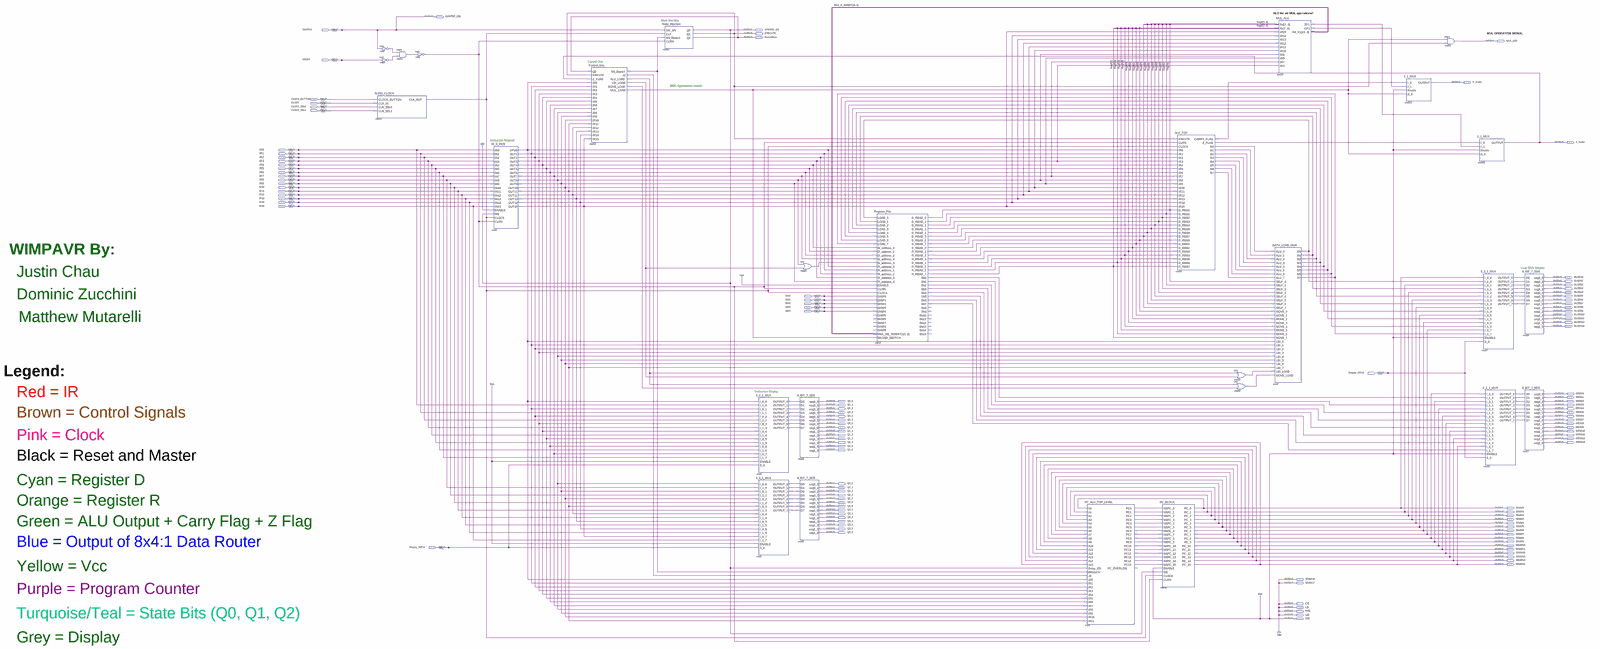
[diagram p0: schematic sheet, whole]
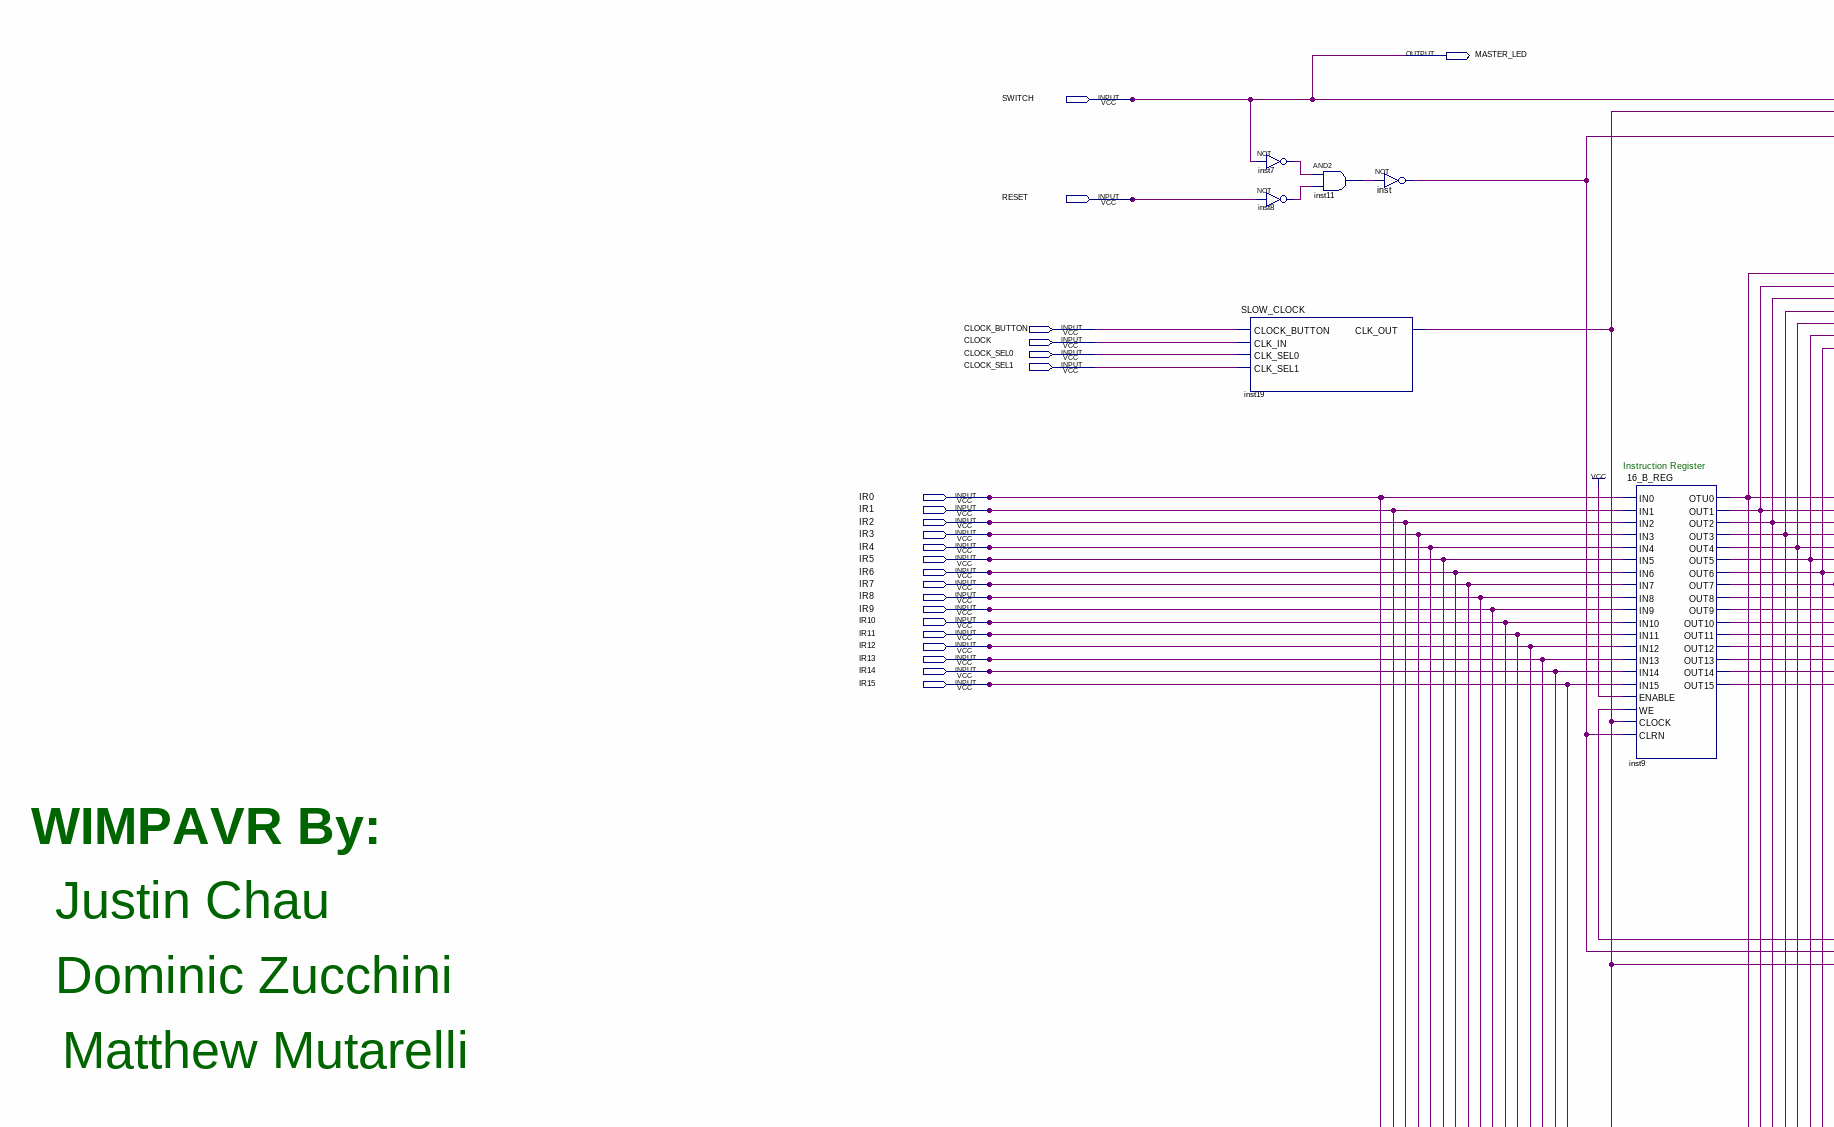
[diagram p1: schematic sheet, upper left part]
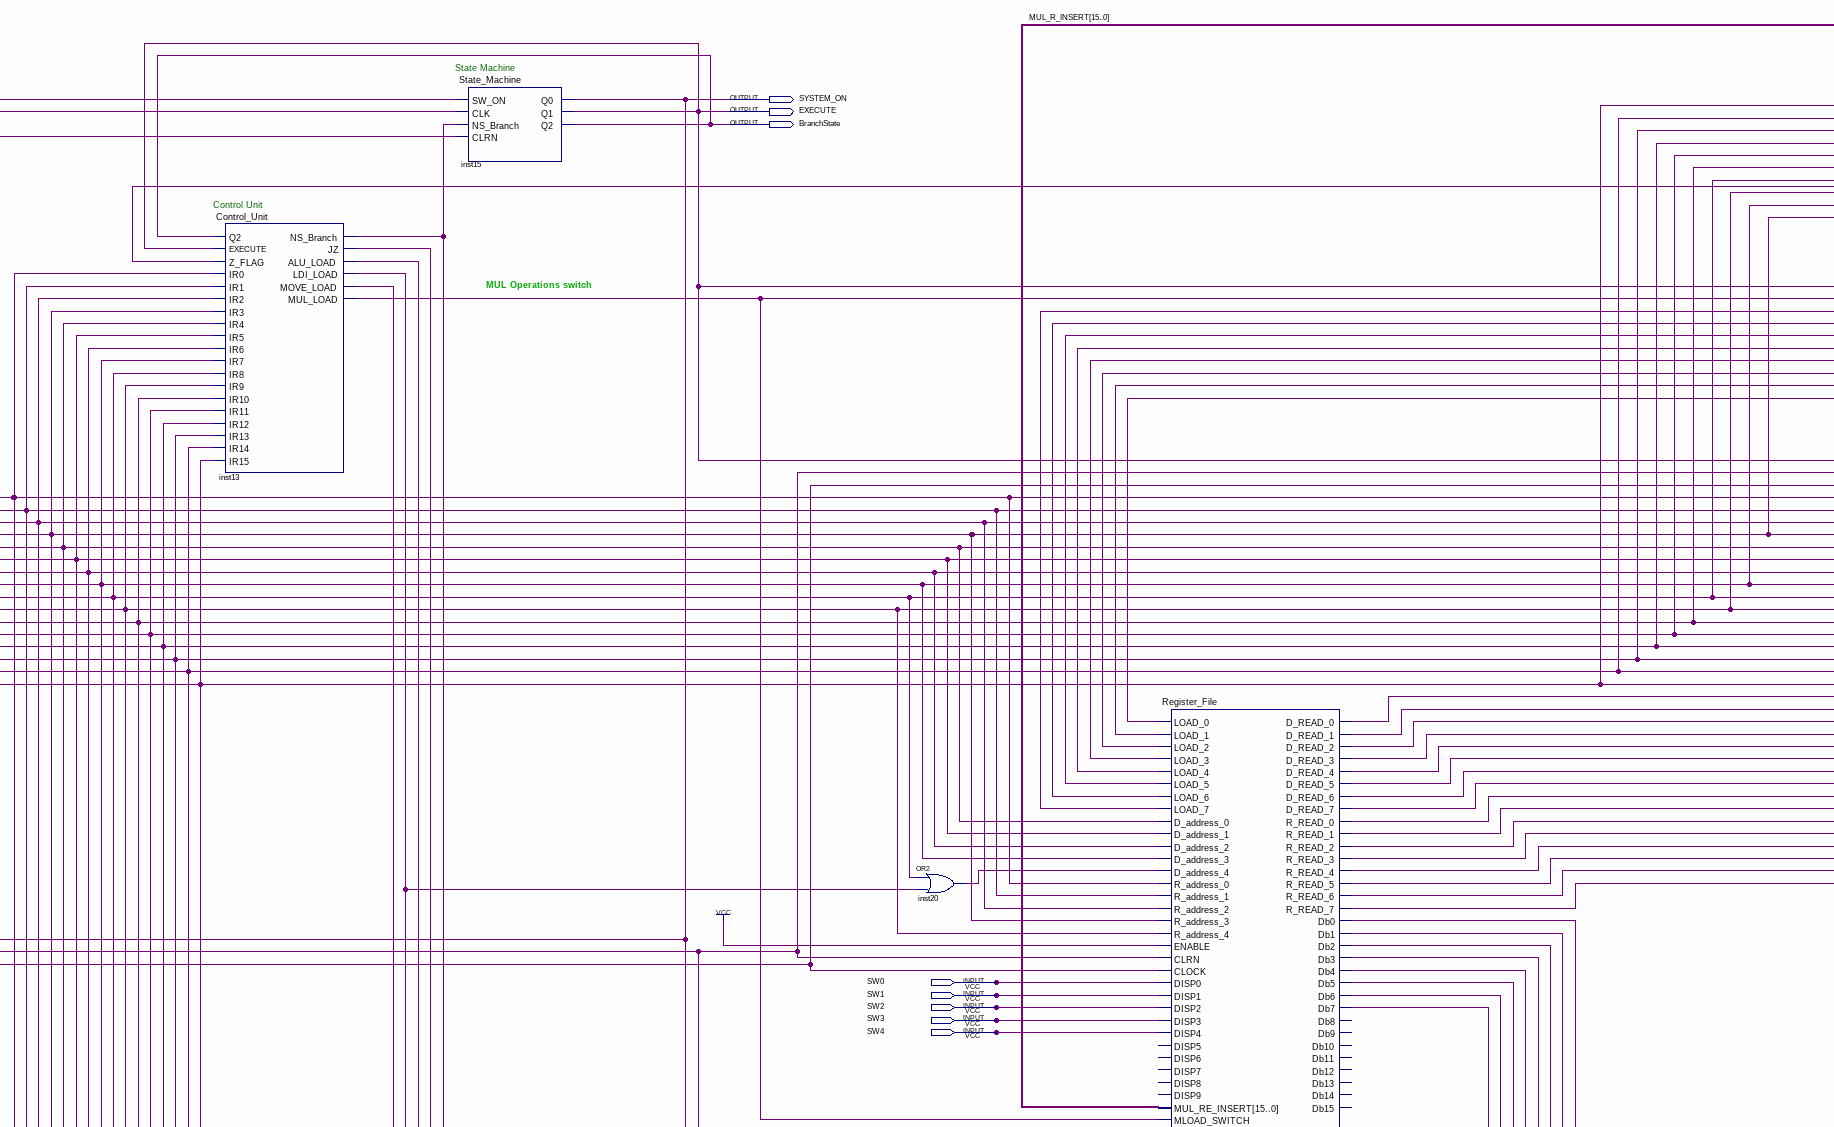
[diagram p2: schematic sheet, upper centre part]
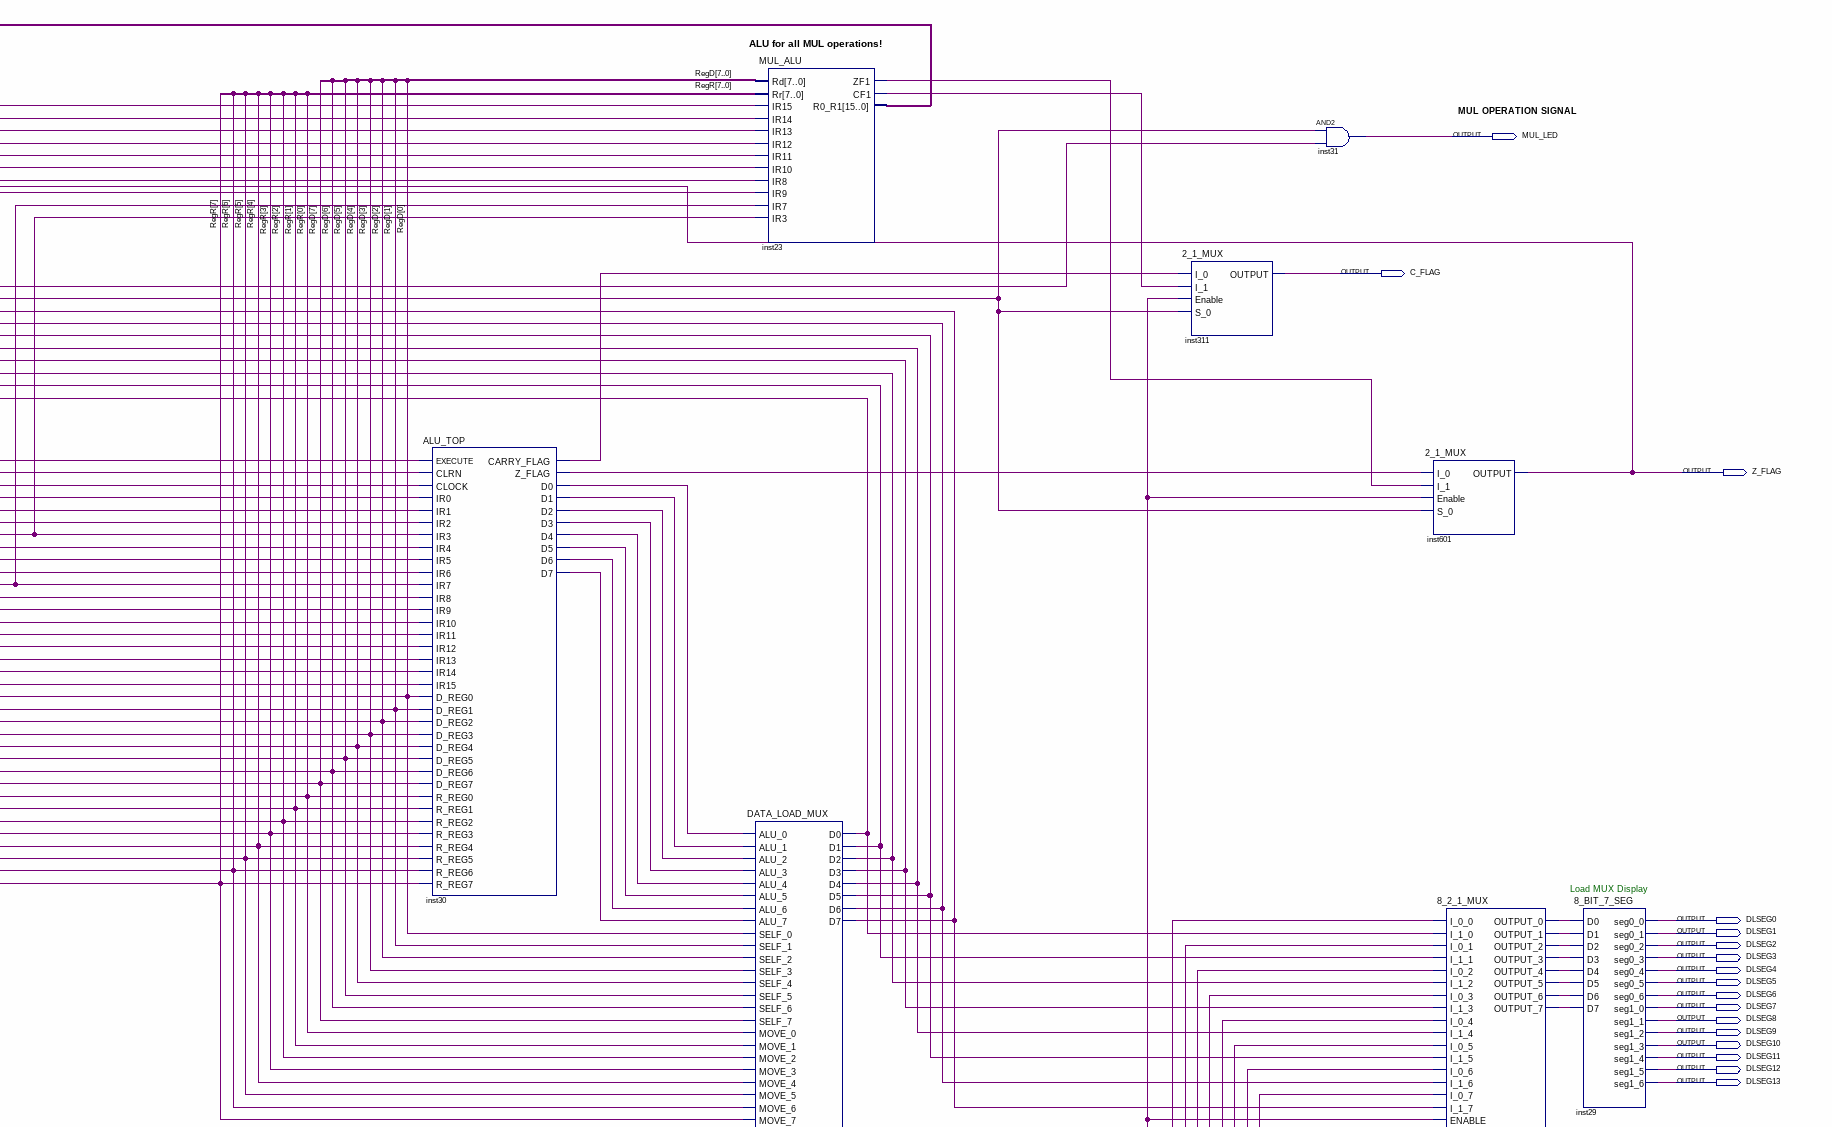
[diagram p3: schematic sheet, upper right part]
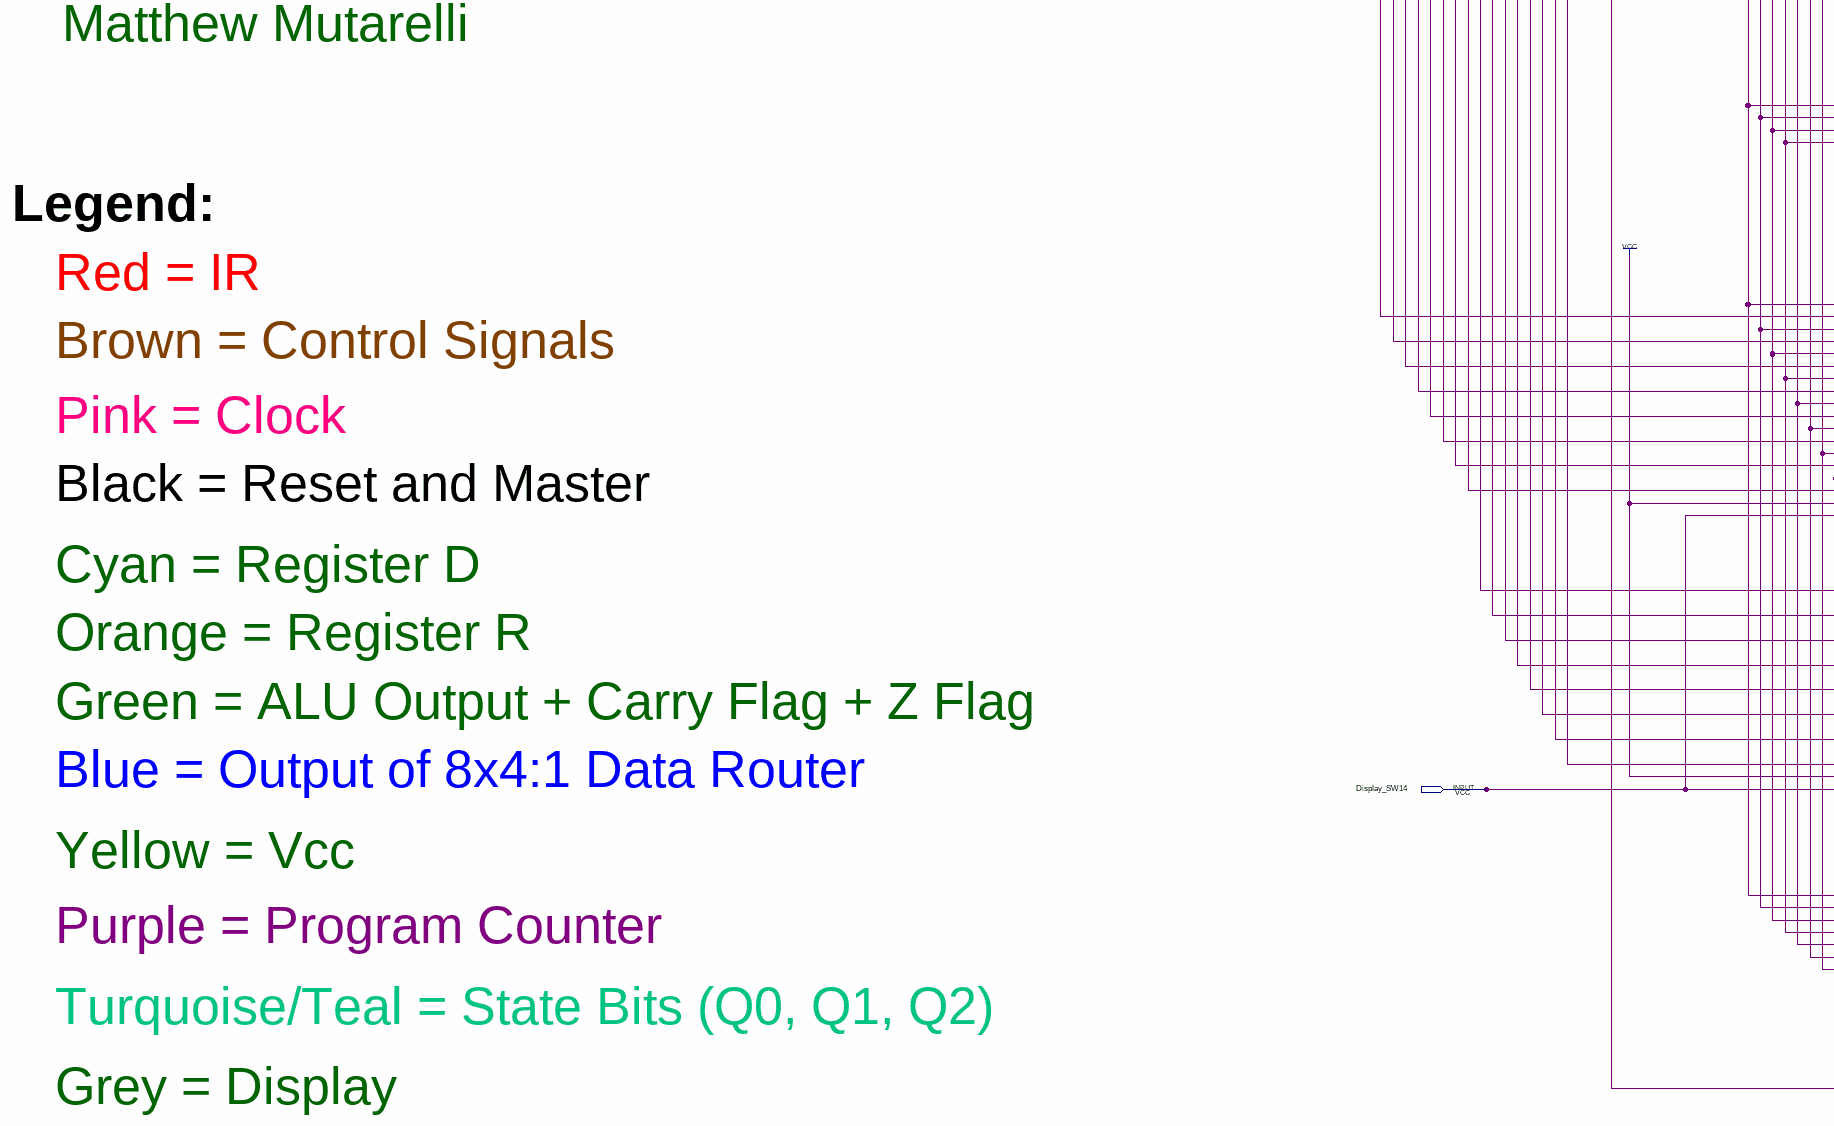
[diagram p4: schematic sheet, lower left part]
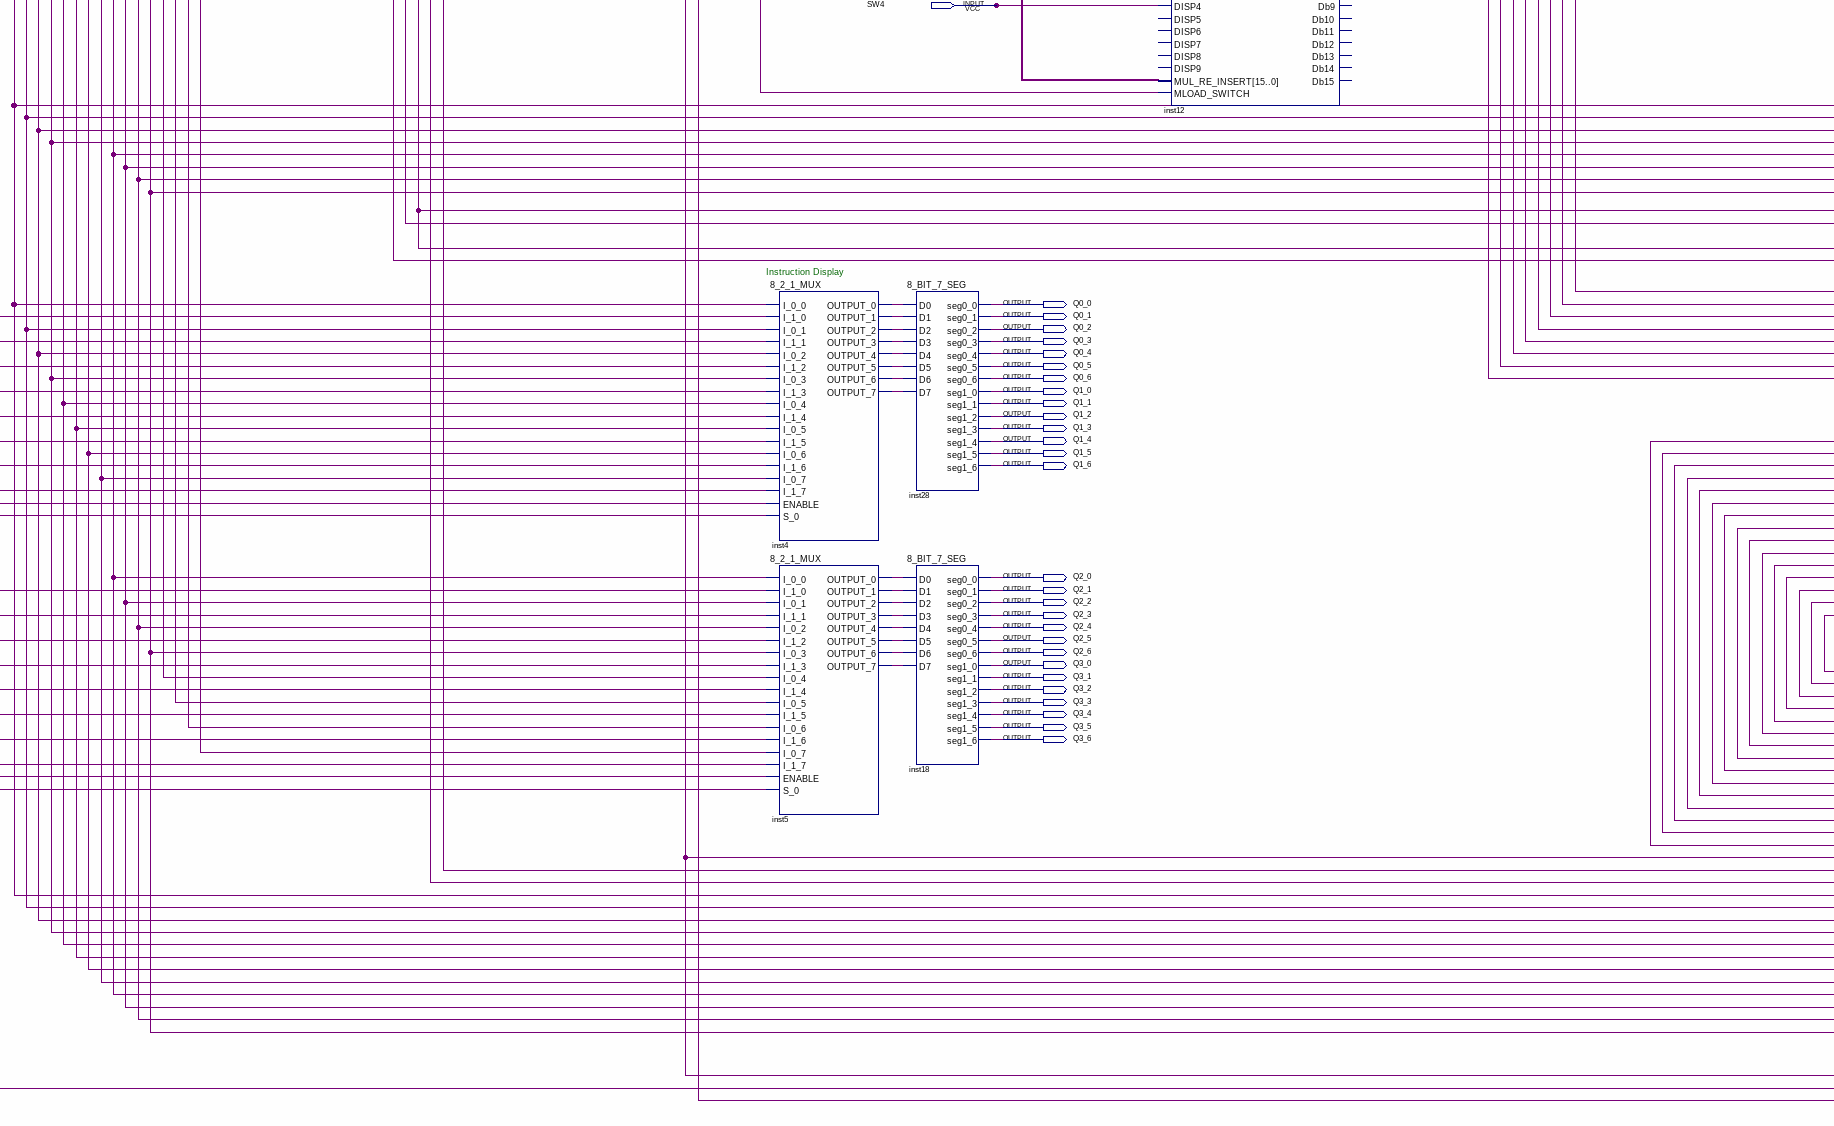
[diagram p5: schematic sheet, lower centre part]
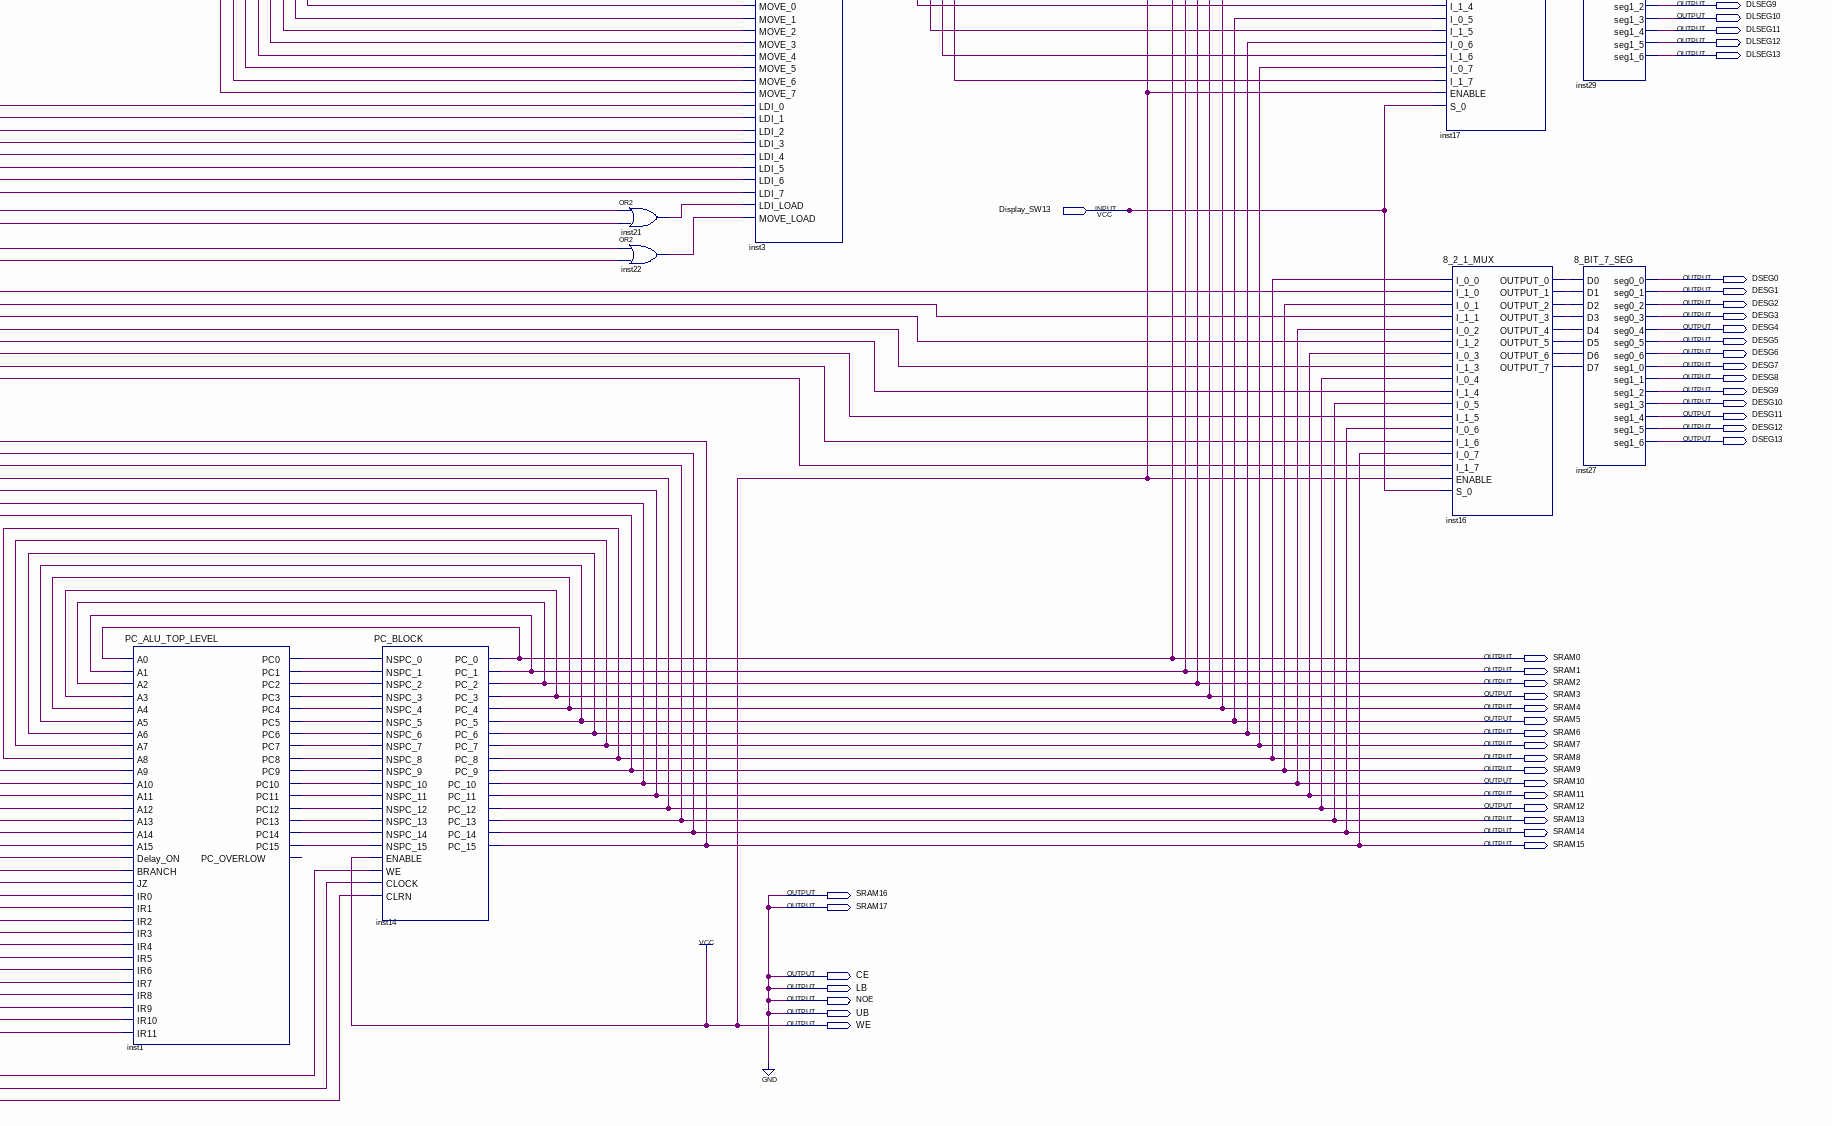
[diagram p6: schematic sheet, lower right part]
// Quartus schematic AVR_TEST.bdf as structural Verilog: 28 symbols, 115 pins
module AVR_TEST (
  input  SWITCH,
  input  RESET,
  input  CLOCK_BUTTON,
  input  CLOCK,
  input  CLOCK_SEL0,
  input  CLOCK_SEL1,
  input  IR0,
  input  IR1,
  input  IR2,
  input  IR3,
  input  IR4,
  input  IR5,
  input  IR6,
  input  IR7,
  input  IR8,
  input  IR9,
  input  IR10,
  input  IR11,
  input  IR12,
  input  IR13,
  input  IR14,
  input  IR15,
  input  SW0,
  input  SW1,
  input  SW2,
  input  SW3,
  input  SW4,
  input  Display_SW13,
  input  Display_SW14,
  output MASTER_LED,
  output SYSTEM_ON,
  output EXECUTE,
  output BranchState,
  output MUL_LED,
  output C_FLAG,
  output Z_FLAG,
  output DLSEG0,
  output DLSEG1,
  output DLSEG2,
  output DLSEG3,
  output DLSEG4,
  output DLSEG5,
  output DLSEG6,
  output DLSEG7,
  output DLSEG8,
  output DLSEG9,
  output DLSEG10,
  output DLSEG11,
  output DLSEG12,
  output DLSEG13,
  output DSEG0,
  output DESG1,
  output Q0_0,
  output DESG2,
  output Q0_1,
  output DESG3,
  output Q0_2,
  output DESG4,
  output Q0_3,
  output DESG5,
  output Q0_4,
  output DESG6,
  output Q0_5,
  output DESG7,
  output Q0_6,
  output DESG8,
  output Q1_0,
  output DESG9,
  output Q1_1,
  output DESG10,
  output Q1_2,
  output DESG11,
  output Q1_3,
  output DESG12,
  output Q1_4,
  output DSEG13,
  output Q1_5,
  output Q1_6,
  output Q2_0,
  output Q2_1,
  output Q2_2,
  output Q2_3,
  output Q2_4,
  output Q2_5,
  output Q2_6,
  output SRAM0,
  output Q3_0,
  output SRAM1,
  output Q3_1,
  output SRAM2,
  output Q3_2,
  output SRAM3,
  output Q3_3,
  output SRAM4,
  output Q3_4,
  output SRAM5,
  output Q3_5,
  output SRAM6,
  output Q3_6,
  output SRAM7,
  output SRAM8,
  output SRAM9,
  output SRAM10,
  output SRAM11,
  output SRAM12,
  output SRAM13,
  output SRAM14,
  output SRAM15,
  output SRAM16,
  output SRAM17,
  output CE,
  output LB,
  output NOE,
  output UB,
  output WE
);

  wire inst1_pc0, inst1_pc1, inst1_pc2, inst1_pc3, inst1_pc4, inst1_pc5, inst1_pc6, inst1_pc7, inst1_pc8,
       inst1_pc9, inst1_pc10, inst1_pc11, inst1_pc12, inst1_pc13, inst1_pc14, inst1_pc15, inst3_d0, inst3_d1,
       inst3_d2, inst3_d3, inst3_d4, inst3_d5, inst3_d6, inst3_d7, inst4_output_0, inst4_output_1,
       inst4_output_2, inst4_output_3, inst4_output_4, inst4_output_5, inst4_output_6, inst4_output_7,
       inst5_output_0, inst5_output_1, inst5_output_2, inst5_output_3, inst5_output_4, inst5_output_5,
       inst5_output_6, inst5_output_7, inst7_out, inst8_out, inst9_otu0, inst9_out1, inst9_out2, inst9_out3,
       inst9_out4, inst9_out5, inst9_out6, inst9_out7, inst9_out8, inst9_out9, inst9_out10, inst9_out11,
       inst9_out12, inst9_out13, inst9_out14, inst9_out15, inst11_out, inst12_db0, inst12_db1, inst12_db2,
       inst12_db3, inst12_db4, inst12_db5, inst12_db6, inst12_db7, inst13_alu_load, inst13_jz,
       inst13_ldi_load, inst13_move_load, inst13_mul_load, inst13_ns_branch, inst16_output_0,
       inst16_output_1, inst16_output_2, inst16_output_3, inst16_output_4, inst16_output_5, inst16_output_6,
       inst16_output_7, inst17_output_0, inst17_output_1, inst17_output_2, inst17_output_3, inst17_output_4,
       inst17_output_5, inst17_output_6, inst17_output_7, inst19_clk_out, inst20_out, inst21_out, inst22_out,
       inst23_cf1, inst23_zf1, inst30_carry_flag, inst30_d0, inst30_d1, inst30_d2, inst30_d3, inst30_d4,
       inst30_d5, inst30_d6, inst30_d7, inst30_z_flag, inst_out;
  wire [7:0] RegD, RegR;
  wire [15:0] MUL_R_INSERT;

  SLOW_CLOCK inst19 (
    .CLOCK_BUTTON(CLOCK_BUTTON), .CLK_IN(CLOCK), .CLK_SEL0(CLOCK_SEL0), .CLK_SEL1(CLOCK_SEL1),
    .CLK_OUT(inst19_clk_out));
  not inst7 (inst7_out, SWITCH);
  not inst8 (inst8_out, RESET);
  and inst11 (inst11_out, inst7_out, inst8_out);
  not inst (inst_out, inst11_out);
  \16_B_REG  inst9 (
    .IN0(IR0), .IN1(IR1), .IN2(IR2), .IN3(IR3), .IN4(IR4), .IN5(IR5), .IN6(IR6), .IN7(IR7), .IN8(IR8),
    .IN9(IR9), .IN10(IR10), .IN11(IR11), .IN12(IR12), .IN13(IR13), .IN14(IR14), .IN15(IR15), .ENABLE(1'b1),
    .WE(SYSTEM_ON), .CLOCK(inst19_clk_out), .CLRN(inst_out), .OTU0(inst9_otu0), .OUT1(inst9_out1),
    .OUT2(inst9_out2), .OUT3(inst9_out3), .OUT4(inst9_out4), .OUT5(inst9_out5), .OUT6(inst9_out6),
    .OUT7(inst9_out7), .OUT8(inst9_out8), .OUT9(inst9_out9), .OUT10(inst9_out10), .OUT11(inst9_out11),
    .OUT12(inst9_out12), .OUT13(inst9_out13), .OUT14(inst9_out14), .OUT15(inst9_out15));
  Control_Unit inst13 (
    .Q2(BranchState), .EXECUTE(EXECUTE), .Z_FLAG(Z_FLAG), .IR0(inst9_otu0), .IR1(inst9_out1),
    .IR2(inst9_out2), .IR3(inst9_out3), .IR4(inst9_out4), .IR5(inst9_out5), .IR6(inst9_out6),
    .IR7(inst9_out7), .IR8(inst9_out8), .IR9(inst9_out9), .IR10(inst9_out10), .IR11(inst9_out11),
    .IR12(inst9_out12), .IR13(inst9_out13), .IR14(inst9_out14), .IR15(inst9_out15),
    .NS_Branch(inst13_ns_branch), .JZ(inst13_jz), .ALU_LOAD(inst13_alu_load), .LDI_LOAD(inst13_ldi_load),
    .MOVE_LOAD(inst13_move_load), .MUL_LOAD(inst13_mul_load));
  State_Machine inst15 (
    .SW_ON(SWITCH), .CLK(inst19_clk_out), .NS_Branch(inst13_ns_branch), .CLRN(inst_out), .Q0(SYSTEM_ON),
    .Q1(EXECUTE), .Q2(BranchState));
  \8_2_1_MUX  inst4 (
    .I_0_0(inst9_otu0), .I_1_0(IR0), .I_0_1(inst9_out1), .I_1_1(IR1), .I_0_2(inst9_out2), .I_1_2(IR2),
    .I_0_3(inst9_out3), .I_1_3(IR3), .I_0_4(inst9_out4), .I_1_4(IR4), .I_0_5(inst9_out5), .I_1_5(IR5),
    .I_0_6(inst9_out6), .I_1_6(IR6), .I_0_7(inst9_out7), .I_1_7(IR7), .ENABLE(1'b1), .S_0(Display_SW14),
    .OUTPUT_0(inst4_output_0), .OUTPUT_1(inst4_output_1), .OUTPUT_2(inst4_output_2),
    .OUTPUT_3(inst4_output_3), .OUTPUT_4(inst4_output_4), .OUTPUT_5(inst4_output_5),
    .OUTPUT_6(inst4_output_6), .OUTPUT_7(inst4_output_7));
  \8_2_1_MUX  inst5 (
    .I_0_0(inst9_out8), .I_1_0(IR8), .I_0_1(inst9_out9), .I_1_1(IR9), .I_0_2(inst9_out10), .I_1_2(IR10),
    .I_0_3(inst9_out11), .I_1_3(IR11), .I_0_4(inst9_out12), .I_1_4(IR12), .I_0_5(inst9_out13), .I_1_5(IR13),
    .I_0_6(inst9_out14), .I_1_6(IR14), .I_0_7(inst9_out15), .I_1_7(IR15), .ENABLE(1'b1), .S_0(Display_SW14),
    .OUTPUT_0(inst5_output_0), .OUTPUT_1(inst5_output_1), .OUTPUT_2(inst5_output_2),
    .OUTPUT_3(inst5_output_3), .OUTPUT_4(inst5_output_4), .OUTPUT_5(inst5_output_5),
    .OUTPUT_6(inst5_output_6), .OUTPUT_7(inst5_output_7));
  \8_BIT_7_SEG  inst28 (
    .D0(inst4_output_0), .D1(inst4_output_1), .D2(inst4_output_2), .D3(inst4_output_3), .D4(inst4_output_4),
    .D5(inst4_output_5), .D6(inst4_output_6), .D7(inst4_output_7), .seg0_0(Q0_0), .seg0_1(Q0_1),
    .seg0_2(Q0_2), .seg0_3(Q0_3), .seg0_4(Q0_4), .seg0_5(Q0_5), .seg0_6(Q0_6), .seg1_0(Q1_0), .seg1_1(Q1_1),
    .seg1_2(Q1_2), .seg1_3(Q1_3), .seg1_4(Q1_4), .seg1_5(Q1_5), .seg1_6(Q1_6));
  \8_BIT_7_SEG  inst18 (
    .D0(inst5_output_0), .D1(inst5_output_1), .D2(inst5_output_2), .D3(inst5_output_3), .D4(inst5_output_4),
    .D5(inst5_output_5), .D6(inst5_output_6), .D7(inst5_output_7), .seg0_0(Q2_0), .seg0_1(Q2_1),
    .seg0_2(Q2_2), .seg0_3(Q2_3), .seg0_4(Q2_4), .seg0_5(Q2_5), .seg0_6(Q2_6), .seg1_0(Q3_0), .seg1_1(Q3_1),
    .seg1_2(Q3_2), .seg1_3(Q3_3), .seg1_4(Q3_4), .seg1_5(Q3_5), .seg1_6(Q3_6));
  or inst20 (inst20_out, inst9_out8, inst13_ldi_load);
  Register_File inst12 (
    .LOAD_0(inst3_d0), .LOAD_1(inst3_d1), .LOAD_2(inst3_d2), .LOAD_3(inst3_d3), .LOAD_4(inst3_d4),
    .LOAD_5(inst3_d5), .LOAD_6(inst3_d6), .LOAD_7(inst3_d7), .D_address_0(inst9_out4),
    .D_address_1(inst9_out5), .D_address_2(inst9_out6), .D_address_3(inst9_out7), .D_address_4(inst20_out),
    .R_address_0(inst9_otu0), .R_address_1(inst9_out1), .R_address_2(inst9_out2), .R_address_3(inst9_out3),
    .R_address_4(inst9_out9), .ENABLE(1'b1), .CLRN(inst_out), .CLOCK(inst19_clk_out), .DISP0(SW0),
    .DISP1(SW1), .DISP2(SW2), .DISP3(SW3), .DISP4(SW4), .MUL_RE_INSERT(MUL_R_INSERT),
    .MLOAD_SWITCH(inst13_mul_load), .D_READ_0(RegD[0]), .D_READ_1(RegD[1]), .D_READ_2(RegD[2]),
    .D_READ_3(RegD[3]), .D_READ_4(RegD[4]), .D_READ_5(RegD[5]), .D_READ_6(RegD[6]), .D_READ_7(RegD[7]),
    .R_READ_0(RegR[0]), .R_READ_1(RegR[1]), .R_READ_2(RegR[2]), .R_READ_3(RegR[3]), .R_READ_4(RegR[4]),
    .R_READ_5(RegR[5]), .R_READ_6(RegR[6]), .R_READ_7(RegR[7]), .Db0(inst12_db0), .Db1(inst12_db1),
    .Db2(inst12_db2), .Db3(inst12_db3), .Db4(inst12_db4), .Db5(inst12_db5), .Db6(inst12_db6), .Db7(inst12_db7));  // open: DISP5, DISP6, DISP7, DISP8, DISP9, Db8, Db9, Db10, Db11, Db12, Db13, Db14, Db15
  PC_ALU_TOP_LEVEL inst1 (
    .A0(SRAM0), .A1(SRAM1), .A2(SRAM2), .A3(SRAM3), .A4(SRAM4), .A5(SRAM5), .A6(SRAM6), .A7(SRAM7),
    .A8(SRAM8), .A9(SRAM9), .A10(SRAM10), .A11(SRAM11), .A12(SRAM12), .A13(SRAM13), .A14(SRAM14),
    .A15(SRAM15), .Delay_ON(SYSTEM_ON), .BRANCH(inst13_ns_branch), .JZ(inst13_jz), .IR0(inst9_otu0),
    .IR1(inst9_out1), .IR2(inst9_out2), .IR3(inst9_out3), .IR4(inst9_out4), .IR5(inst9_out5),
    .IR6(inst9_out6), .IR7(inst9_out7), .IR8(inst9_out8), .IR9(inst9_out9), .IR10(inst9_out10),
    .IR11(inst9_out11), .PC0(inst1_pc0), .PC1(inst1_pc1), .PC2(inst1_pc2), .PC3(inst1_pc3), .PC4(inst1_pc4),
    .PC5(inst1_pc5), .PC6(inst1_pc6), .PC7(inst1_pc7), .PC8(inst1_pc8), .PC9(inst1_pc9), .PC10(inst1_pc10),
    .PC11(inst1_pc11), .PC12(inst1_pc12), .PC13(inst1_pc13), .PC14(inst1_pc14), .PC15(inst1_pc15));  // open: PC_OVERLOW
  PC_BLOCK inst14 (
    .NSPC_0(inst1_pc0), .NSPC_1(inst1_pc1), .NSPC_2(inst1_pc2), .NSPC_3(inst1_pc3), .NSPC_4(inst1_pc4),
    .NSPC_5(inst1_pc5), .NSPC_6(inst1_pc6), .NSPC_7(inst1_pc7), .NSPC_8(inst1_pc8), .NSPC_9(inst1_pc9),
    .NSPC_10(inst1_pc10), .NSPC_11(inst1_pc11), .NSPC_12(inst1_pc12), .NSPC_13(inst1_pc13),
    .NSPC_14(inst1_pc14), .NSPC_15(inst1_pc15), .ENABLE(1'b1), .WE(SYSTEM_ON), .CLOCK(inst19_clk_out),
    .CLRN(inst_out), .PC_0(SRAM0), .PC_1(SRAM1), .PC_2(SRAM2), .PC_3(SRAM3), .PC_4(SRAM4), .PC_5(SRAM5),
    .PC_6(SRAM6), .PC_7(SRAM7), .PC_8(SRAM8), .PC_9(SRAM9), .PC_10(SRAM10), .PC_11(SRAM11), .PC_12(SRAM12),
    .PC_13(SRAM13), .PC_14(SRAM14), .PC_15(SRAM15));
  ALU_TOP inst30 (
    .EXECUTE(EXECUTE), .CLRN(inst_out), .CLOCK(inst19_clk_out), .IR0(inst9_otu0), .IR1(inst9_out1),
    .IR2(inst9_out2), .IR3(inst9_out3), .IR4(inst9_out4), .IR5(inst9_out5), .IR6(inst9_out6),
    .IR7(inst9_out7), .IR8(inst9_out8), .IR9(inst9_out9), .IR10(inst9_out10), .IR11(inst9_out11),
    .IR12(inst9_out12), .IR13(inst9_out13), .IR14(inst9_out14), .IR15(inst9_out15), .D_REG0(RegD[0]),
    .D_REG1(RegD[1]), .D_REG2(RegD[2]), .D_REG3(RegD[3]), .D_REG4(RegD[4]), .D_REG5(RegD[5]),
    .D_REG6(RegD[6]), .D_REG7(RegD[7]), .R_REG0(RegR[0]), .R_REG1(RegR[1]), .R_REG2(RegR[2]),
    .R_REG3(RegR[3]), .R_REG4(RegR[4]), .R_REG5(RegR[5]), .R_REG6(RegR[6]), .R_REG7(RegR[7]),
    .CARRY_FLAG(inst30_carry_flag), .Z_FLAG(inst30_z_flag), .D0(inst30_d0), .D1(inst30_d1), .D2(inst30_d2),
    .D3(inst30_d3), .D4(inst30_d4), .D5(inst30_d5), .D6(inst30_d6), .D7(inst30_d7));
  or inst21 (inst21_out, inst13_alu_load, inst13_ldi_load);
  or inst22 (inst22_out, inst13_alu_load, inst13_move_load);
  MUL_ALU inst23 (
    .Rd(RegD), .Rr(RegR), .IR15(inst9_out15), .IR14(inst9_out14), .IR13(inst9_out13), .IR12(inst9_out12),
    .IR11(inst9_out11), .IR10(inst9_out10), .IR8(inst9_out8), .IR9(inst9_out9), .IR7(inst9_out7),
    .IR3(inst9_out3), .ZF1(inst23_zf1), .CF1(inst23_cf1), .R0_R1(MUL_R_INSERT));
  DATA_LOAD_MUX inst3 (
    .ALU_0(inst30_d0), .ALU_1(inst30_d1), .ALU_2(inst30_d2), .ALU_3(inst30_d3), .ALU_4(inst30_d4),
    .ALU_5(inst30_d5), .ALU_6(inst30_d6), .ALU_7(inst30_d7), .SELF_0(RegD[0]), .SELF_1(RegD[1]),
    .SELF_2(RegD[2]), .SELF_3(RegD[3]), .SELF_4(RegD[4]), .SELF_5(RegD[5]), .SELF_6(RegD[6]),
    .SELF_7(RegD[7]), .MOVE_0(RegR[0]), .MOVE_1(RegR[1]), .MOVE_2(RegR[2]), .MOVE_3(RegR[3]),
    .MOVE_4(RegR[4]), .MOVE_5(RegR[5]), .MOVE_6(RegR[6]), .MOVE_7(RegR[7]), .LDI_0(inst9_otu0),
    .LDI_1(inst9_out1), .LDI_2(inst9_out2), .LDI_3(inst9_out3), .LDI_4(inst9_out8), .LDI_5(inst9_out9),
    .LDI_6(inst9_out10), .LDI_7(inst9_out11), .LDI_LOAD(inst21_out), .MOVE_LOAD(inst22_out), .D0(inst3_d0),
    .D1(inst3_d1), .D2(inst3_d2), .D3(inst3_d3), .D4(inst3_d4), .D5(inst3_d5), .D6(inst3_d6), .D7(inst3_d7));
  \2_1_MUX  inst311 (.I_0(inst30_carry_flag), .I_1(inst23_cf1), .Enable(1'b1), .S_0(inst13_mul_load), .OUTPUT(C_FLAG));
  and inst31 (MUL_LED, inst13_mul_load, EXECUTE);
  \2_1_MUX  inst601 (.I_0(inst30_z_flag), .I_1(inst23_zf1), .Enable(1'b1), .S_0(inst13_mul_load), .OUTPUT(Z_FLAG));
  \8_2_1_MUX  inst17 (
    .I_0_0(SRAM0), .I_1_0(inst3_d0), .I_0_1(SRAM1), .I_1_1(inst3_d1), .I_0_2(SRAM2), .I_1_2(inst3_d2),
    .I_0_3(SRAM3), .I_1_3(inst3_d3), .I_0_4(SRAM4), .I_1_4(inst3_d4), .I_0_5(SRAM5), .I_1_5(inst3_d5),
    .I_0_6(SRAM6), .I_1_6(inst3_d6), .I_0_7(SRAM7), .I_1_7(inst3_d7), .ENABLE(1'b1), .S_0(Display_SW13),
    .OUTPUT_0(inst17_output_0), .OUTPUT_1(inst17_output_1), .OUTPUT_2(inst17_output_2),
    .OUTPUT_3(inst17_output_3), .OUTPUT_4(inst17_output_4), .OUTPUT_5(inst17_output_5),
    .OUTPUT_6(inst17_output_6), .OUTPUT_7(inst17_output_7));
  \8_2_1_MUX  inst16 (
    .I_0_0(SRAM8), .I_1_0(inst12_db0), .I_0_1(SRAM9), .I_1_1(inst12_db1), .I_0_2(SRAM10), .I_1_2(inst12_db2),
    .I_0_3(SRAM11), .I_1_3(inst12_db3), .I_0_4(SRAM12), .I_1_4(inst12_db4), .I_0_5(SRAM13),
    .I_1_5(inst12_db5), .I_0_6(SRAM14), .I_1_6(inst12_db6), .I_0_7(SRAM15), .I_1_7(inst12_db7),
    .ENABLE(1'b1), .S_0(Display_SW13), .OUTPUT_0(inst16_output_0), .OUTPUT_1(inst16_output_1),
    .OUTPUT_2(inst16_output_2), .OUTPUT_3(inst16_output_3), .OUTPUT_4(inst16_output_4),
    .OUTPUT_5(inst16_output_5), .OUTPUT_6(inst16_output_6), .OUTPUT_7(inst16_output_7));
  \8_BIT_7_SEG  inst29 (
    .D0(inst17_output_0), .D1(inst17_output_1), .D2(inst17_output_2), .D3(inst17_output_3),
    .D4(inst17_output_4), .D5(inst17_output_5), .D6(inst17_output_6), .D7(inst17_output_7), .seg0_0(DLSEG0),
    .seg0_1(DLSEG1), .seg0_2(DLSEG2), .seg0_3(DLSEG3), .seg0_4(DLSEG4), .seg0_5(DLSEG5), .seg0_6(DLSEG6),
    .seg1_0(DLSEG7), .seg1_1(DLSEG8), .seg1_2(DLSEG9), .seg1_3(DLSEG10), .seg1_4(DLSEG11), .seg1_5(DLSEG12),
    .seg1_6(DLSEG13));
  \8_BIT_7_SEG  inst27 (
    .D0(inst16_output_0), .D1(inst16_output_1), .D2(inst16_output_2), .D3(inst16_output_3),
    .D4(inst16_output_4), .D5(inst16_output_5), .D6(inst16_output_6), .D7(inst16_output_7), .seg0_0(DSEG0),
    .seg0_1(DESG1), .seg0_2(DESG2), .seg0_3(DESG3), .seg0_4(DESG4), .seg0_5(DESG5), .seg0_6(DESG6),
    .seg1_0(DESG7), .seg1_1(DESG8), .seg1_2(DESG9), .seg1_3(DESG10), .seg1_4(DESG11), .seg1_5(DESG12),
    .seg1_6(DSEG13));

  assign CE = 1'b0;
  assign LB = 1'b0;
  assign MASTER_LED = SWITCH;
  assign NOE = 1'b0;
  assign SRAM16 = 1'b0;
  assign SRAM17 = 1'b0;
  assign UB = 1'b0;
  assign WE = 1'b1;

  // Notes on the sheet:
  //   ALU for all MUL operations!
  //   State Machine
  //   MUL OPERATION SIGNAL
  //   Control Unit
  //   MUL Operations switch
  //   Instruction Register
  //   WIMPAVR By:
  //   Justin Chau
  //   Load MUX Display
  //   Dominic Zucchini
  //   Matthew Mutarelli
  //   Legend:
  //   Red = IR
  //   Instruction Display
  //   Brown = Control Signals
  //   Pink = Clock
  //   Black = Reset and Master
  //   Cyan = Register D
  //   Orange = Register R
  //   Green = ALU Output + Carry Flag + Z Flag
  //   Blue = Output of 8x4:1 Data Router
  //   Yellow = Vcc
  //   Purple = Program Counter
  //   Turquoise/Teal = State Bits (Q0, Q1, Q2)
  //   Grey = Display
endmodule
